# EAGLE design Development (EAGLE 7.2.0)
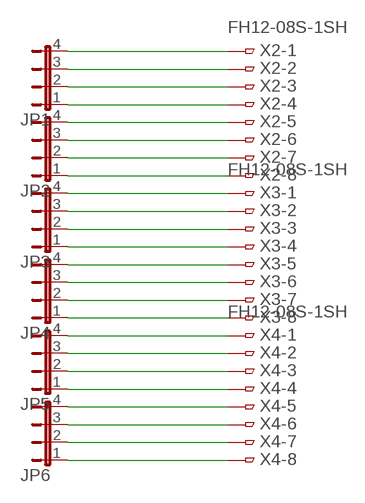
[diagram p0: schematic, sheet 1]

## Parts
JP1  JP4E  [JP4]
JP2  JP4E  [JP4]
JP3  JP4E  [JP4]
JP4  JP4E  [JP4]
JP5  JP4E  [JP4]
JP6  JP4E  [JP4]
X2  FH12-08S-1SH  [FH12-08S-1SH]
X3  FH12-08S-1SH  [FH12-08S-1SH]
X4  FH12-08S-1SH  [FH12-08S-1SH]

## Nets
N$1: JP1.4 X2.1
N$2: JP1.3 X2.2
N$3: JP1.2 X2.3
N$4: JP1.1 X2.4
N$5: JP2.4 X2.5
N$6: JP2.3 X2.6
N$7: JP2.2 X2.7
N$8: JP2.1 X2.8
N$9: JP3.4 X3.1
N$10: JP3.3 X3.2
N$11: JP3.2 X3.3
N$12: JP3.1 X3.4
N$13: JP4.4 X3.5
N$14: JP4.3 X3.6
N$15: JP4.2 X3.7
N$16: JP4.1 X3.8
N$17: JP5.4 X4.1
N$18: JP5.3 X4.2
N$19: JP5.2 X4.3
N$20: JP5.1 X4.4
N$21: JP6.4 X4.5
N$22: JP6.3 X4.6
N$23: JP6.2 X4.7
N$24: JP6.1 X4.8

## Library data of the parts
JP1-JP6 = jumper:JP4E: JUMPER
X2-X4 = con-hirose:FH12-08S-1S: 1mm Pitch Connectors For FPC/FFC Source: Data sheet <http://www.hirose.co.jp/cataloge_hp/e58605370.pdf>; OC_FARNELL: unknown; OC_NEWARK: unknown

## Board
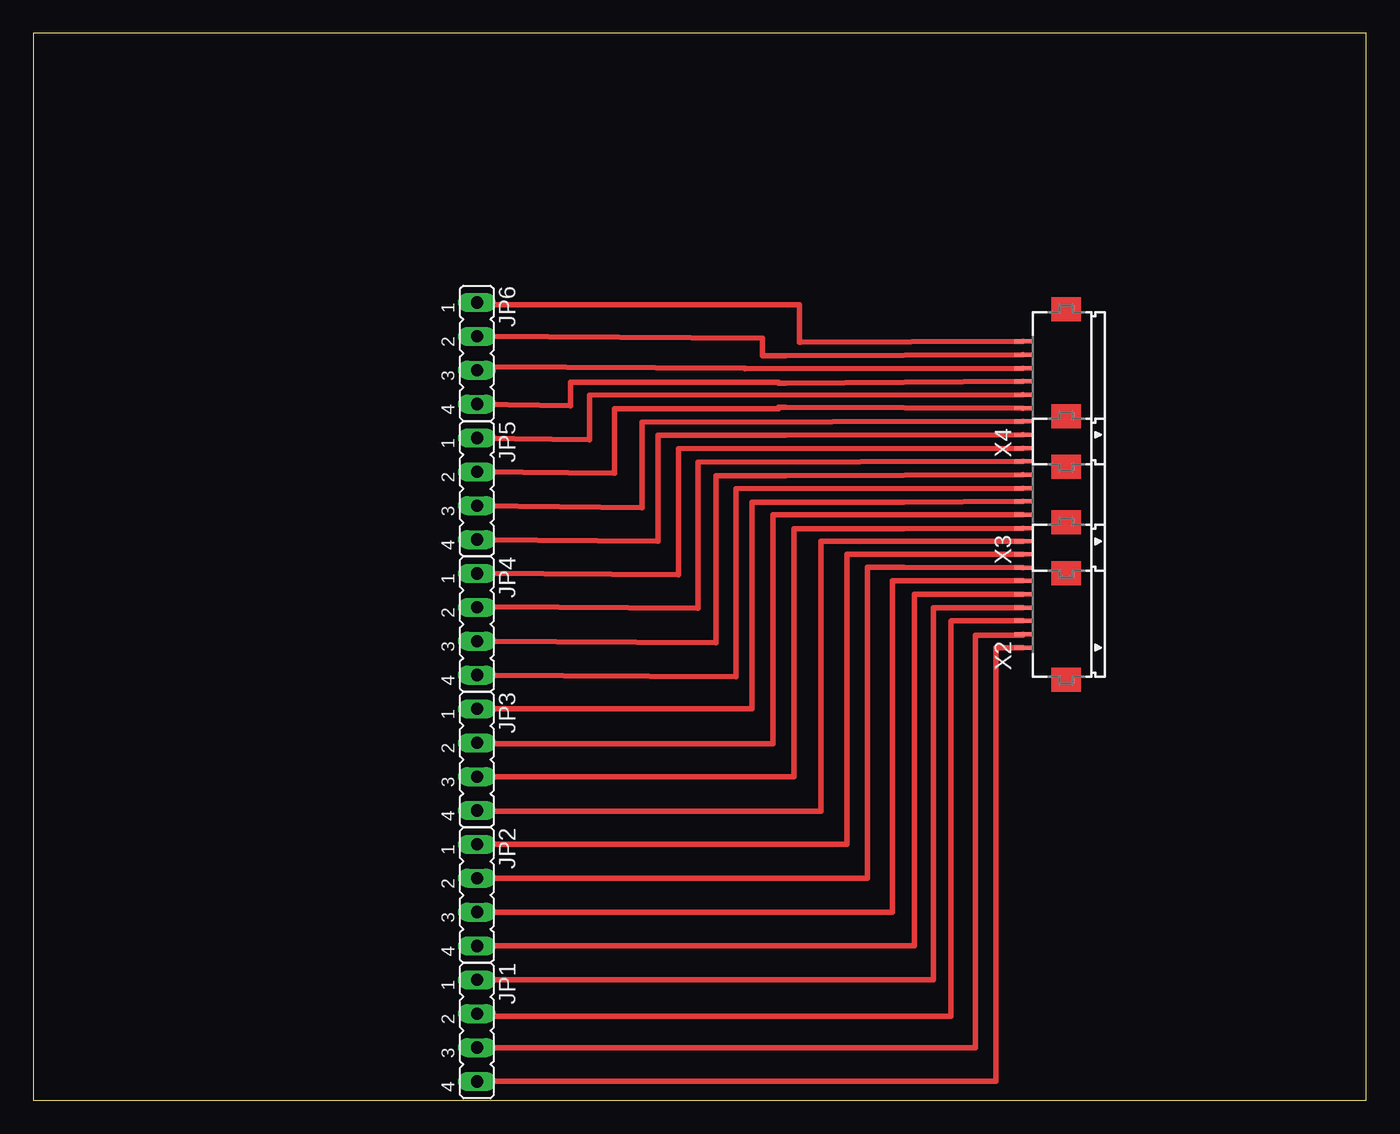
[diagram p1: board, top side]

Size 100 x 80 mm. Coordinates in mm from the lower left corner, seen from the top.
Outline: 0,0 100,0 100,80 0,80 0,0
Copper layers (1*16): Top 0.035mm / dielectric 1.5mm / Bottom 0.035mm
Design rules "default": minimum track width 10mil, minimum drill 24mil, track to track 8mil, track to pad 8mil, pad to pad 8mil, via to via 8mil, smd to smd 8mil, copper to edge 40mil, drill to drill 8mil, minimum pad ring 10mil, minimum via ring 8mil, stop-mask expansion 4mil, vias tented up to drill 0mil, thermal gap 10mil

### Footprints (pad centres in the part's own frame; a part is rotated, then mirrored left to right if it is on the bottom)
JP4 = drill 0.914 long: 1 -3.81,0; 2 -1.27,0; 3 1.27,0; 4 3.81,0
FH12-08S-1SH = smd 0.3 x 1.3: 1 -3.5,3.25; 2 -2.5,3.25; 3 -1.5,3.25; 4 -0.5,3.25; 5 0.5,3.25; 6 1.5,3.25; 7 2.5,3.25; 8 3.5,3.25

### Placement (x,y rotation side)
JP1  33.28,5.2 270 top
JP2  33.28,15.36 270 top
JP3  33.28,25.52 270 top
JP4  33.28,35.68 270 top
JP5  33.28,45.84 270 top
JP6  33.28,56 270 top
X2  77.5,37.43 90 top
X3  77.5,45.39 90 top
X4  77.5,53.39 90 top

### Tracks (layer width: path | path; a pad name or v marks a point on that pad's centre or on a via)
N$1
  Top 0.406: X2.1 72.23,33.93 72.23,1.39 JP1.4
N$2
  Top 0.406: X2.2 74.25,34.87 70.69,34.87 70.69,3.93 JP1.3
N$3
  Top 0.406: JP1.2 33.28,6.27 68.86,6.27 68.86,35.92 68.89,35.92 68.89,35.93 X2.3
N$4
  Top 0.406: X2.4 70.49,36.91 67.54,36.91 67.54,9.01 JP1.1
N$5
  Top 0.406: X2.5 70.49,37.93 66.09,37.93 66.09,11.55 JP2.4
N$6
  Top 0.406: X2.6 70.49,38.96 64.47,38.96 64.47,14.09 JP2.3
N$7
  Top 0.406: X2.7 65.27,39.94 62.56,39.94 62.56,16.63 JP2.2
N$8
  Top 0.406: X2.8 65.27,40.95 61.03,40.95 61.03,19.17 JP2.1
N$9
  Top 0.406: JP3.4 33.28,21.67 59.11,21.67 59.11,41.92 59.18,41.92 59.18,41.89 X3.1
N$10
  Top 0.406: X3.2 65.28,42.84 57.05,42.84 57.05,24.25 JP3.3
N$11
  Top 0.406: JP3.2 33.28,26.71 55.49,26.71 55.49,43.89 X3.3
N$12
  Top 0.406: X3.4 65.28,44.83 53.93,44.83 53.93,29.33 JP3.1
N$13
  Top 0.406: X3.5 52.71,45.83 52.71,31.74 JP4.4
N$14
  Top 0.406: JP4.3 51.23,34.29 51.23,46.83 56.44,46.83 X3.6
N$15
  Top 0.406: X3.7 49.85,47.83 49.85,36.87 34.23,36.99 34.23,36.94 34.04,36.94 34.04,36.99 33.28,36.99 JP4.2
N$16
  Top 0.406: X3.8 48.4,48.83 48.4,39.38 33.28,39.51 JP4.1
N$17
  Top 0.406: JP5.4 46.88,41.91 46.88,49.85 56.44,49.85 X4.1
N$18
  Top 0.406: X4.2 45.69,50.84 45.69,44.43 33.28,44.56 JP5.3
N$19
  Top 0.406: JP5.2 43.59,46.99 43.59,51.83 55.91,51.83 55.91,51.95 56.44,51.95 X4.3
N$20
  Top 0.406: X4.4 41.75,52.84 41.75,49.53 JP5.1
N$21
  Top 0.406: JP6.4 40.31,52.07 40.31,53.84 55.91,53.84 55.91,53.76 56.44,53.76 X4.5
N$22
  Top 0.406: X4.6 53.4,54.84 53.4,54.86 33.28,54.99 JP6.3
N$23
  Top 0.406: JP6.2 54.72,57.15 54.72,55.81 56.44,55.81 X4.7
N$24
  Top 0.406: X4.8 57.5,56.85 57.48,56.85 57.48,59.65 33.28,59.65 JP6.1